# EAGLE schematic hat v1 (EAGLE 9.4.0)

## Sheet 1 of 2
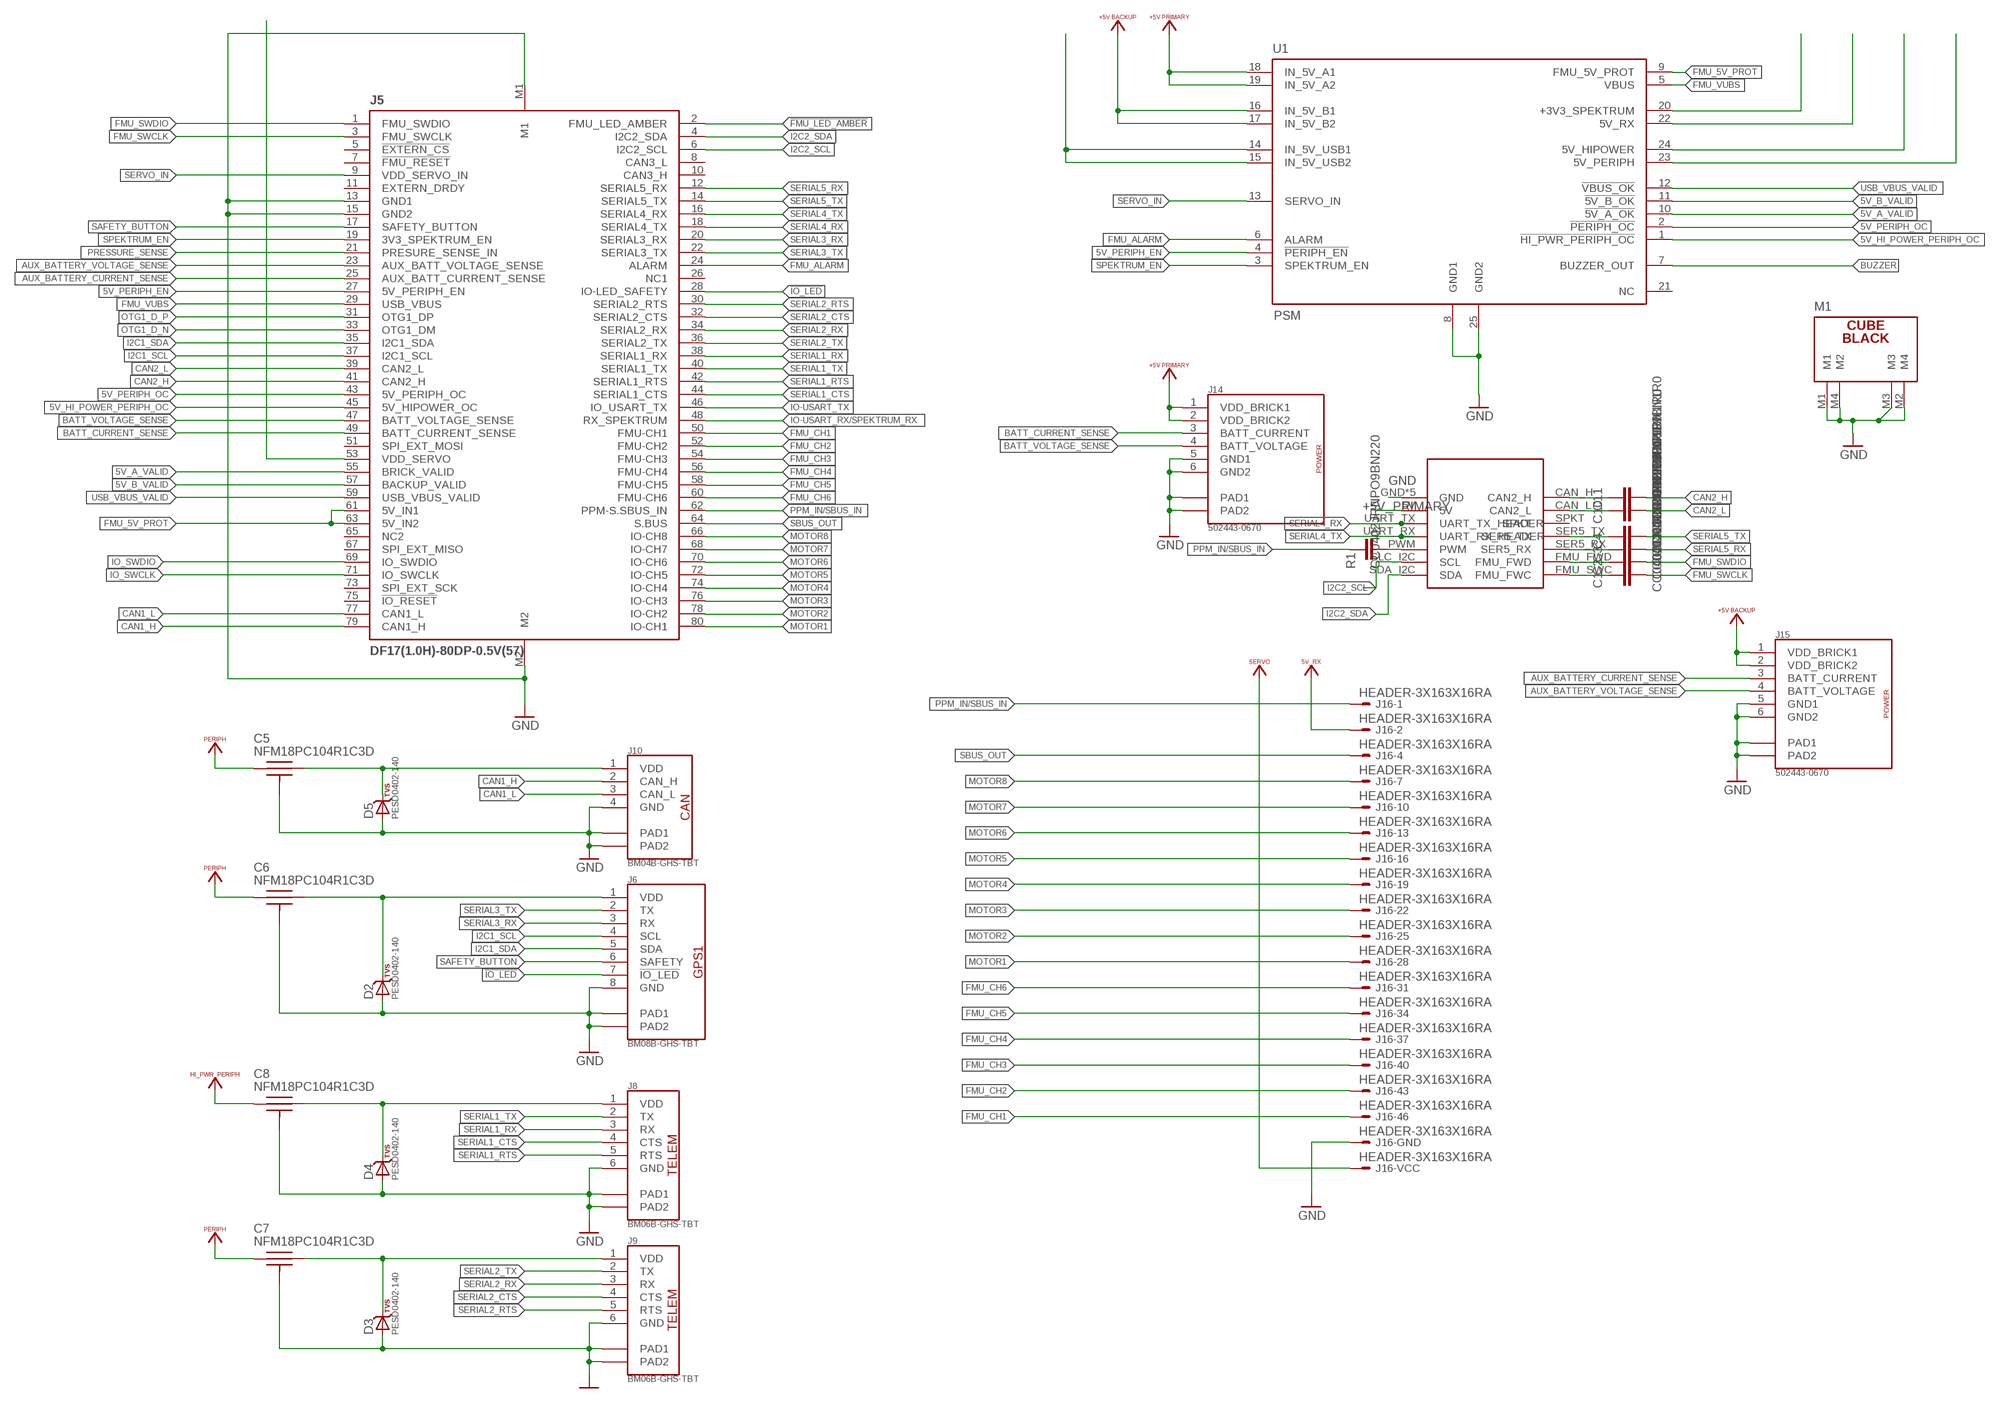
[diagram p0: schematic, sheet 1]

### Parts
C1  CC0402CRNPO9BN1R0  [CAP_0402]
C2  CC0402CRNPO9BN1R0  [CAP_0402]
C3  CC0402CRNPO9BN1R0  [CAP_0402]
C4  CC0402CRNPO9BN1R0  [CAP_0402]
C5  NFM18PC104R1C3D  [KYOCERA-KNH16-DA]
C6  NFM18PC104R1C3D  [KYOCERA-KNH16-DA]
C7  NFM18PC104R1C3D  [KYOCERA-KNH16-DA]
C8  NFM18PC104R1C3D  [KYOCERA-KNH16-DA]
C10  CC0402CRNPO9BN1R0  [CAP_0402]
C11  CC0402CRNPO9BN1R0  [CAP_0402]
D2  PESD0402-140  DIODE-TVS  [0402-TVS]
D3  PESD0402-140  DIODE-TVS  [0402-TVS]
D4  PESD0402-140  DIODE-TVS  [0402-TVS]
D5  PESD0402-140  DIODE-TVS  [0402-TVS]
J5  DF17(1.0H)-80DP-0.5V(57)  [DF17(1.0H)-80DP-0.5V(57)]
J6  BM08B-GHS-TBT  GPS1_CONNECTORS-TBTB  [BM08B-GHS-TBT]
J8  BM06B-GHS-TBT  TELEM_CONNECTORS-TBTB  [BM06B-GHS-TBT]
J9  BM06B-GHS-TBT  TELEM_CONNECTORS-TBTB  [BM06B-GHS-TBT]
J10  BM04B-GHS-TBT  CAN_CONNECTORS-TBTB  [BM04B-GHS-TBT]
J14  502443-0670  POWER_CONNECTOR43  [502443-0670]
J15  502443-0670  POWER_CONNECTOR43  [502443-0670]
J16  HEADER-3X163X16RA  [3X16RA]
M1  CUBE_BLACK  [CUBE]
R1  CC0402JRNPO9BN220  [CAP_0402]
U1  PSM  [PSM]
U$1  RPI  [RPI]

### Nets
5V_A_VALID: J5.55(BRICK_VALID) U1.10(!5V_A_OK)
5V_B_VALID: J5.57(BACKUP_VALID) U1.11(!5V_B_OK)
5V_HI_POWER_PERIPH_OC: J5.45(5V_HIPOWER_OC) U1.1(!HI_PWR_PERIPH_OC)
5V_PERIPH_EN: J5.27(5V_PERIPH_EN) U1.4(!PERIPH_EN)
5V_PERIPH_OC: J5.43(5V_PERIPH_OC) U1.2(!PERIPH_OC)
!FMU_LED_AMBER: J5.2(FMU_LED_AMBER)
!IO_LED: J5.28(IO-LED_SAFETY) J6.7(!IO_LED)
+3V3_SPEKTRUM: U1.20(+3V3_SPEKTRUM)
+5V_BACKUP: J15.1(VDD_BRICK1) J15.2(VDD_BRICK2) U1.16(IN_5V_B1) U1.17(IN_5V_B2)
+5V_PRIMARY: J14.1(VDD_BRICK1) J14.2(VDD_BRICK2) U1.18(IN_5V_A1) U1.19(IN_5V_A2) U$1.5V
AUX_BATTERY_CURRENT_SENSE: J5.25(AUX_BATT_CURRENT_SENSE) J15.3(BATT_CURRENT)
AUX_BATTERY_VOLTAGE_SENSE: J5.23(AUX_BATT_VOLTAGE_SENSE) J15.4(BATT_VOLTAGE)
BATT_CURRENT_SENSE: J5.49(BATT_CURRENT_SENSE) J14.3(BATT_CURRENT)
BATT_VOLTAGE_SENSE: J5.47(BATT_VOLTAGE_SENSE) J14.4(BATT_VOLTAGE)
BUZZER: U1.7(BUZZER_OUT)
CAN1_H: J5.79(CAN1_H) J10.2(CAN_H)
CAN1_L: J5.77(CAN1_L) J10.3(CAN_L)
CAN2_H: C11.2 J5.41(CAN2_H)
CAN2_L: C10.2 J5.39(CAN2_L)
FMU_5V_PROT: J5.61(5V_IN1) J5.63(5V_IN2) U1.9(FMU_5V_PROT)
FMU_ALARM: J5.24(ALARM) U1.6(ALARM)
FMU_CH1: J5.50(FMU-CH1) J16.46
FMU_CH2: J5.52(FMU-CH2) J16.43
FMU_CH3: J5.54(FMU-CH3) J16.40
FMU_CH4: J5.56(FMU-CH4) J16.37
FMU_CH5: J5.58(FMU-CH5) J16.34
FMU_CH6: J5.60(FMU-CH6) J16.31
FMU_SWCLK: C1.2 J5.3(FMU_SWCLK)
FMU_SWDIO: C2.2 J5.1(FMU_SWDIO)
FMU_VUBS: J5.29(USB_VBUS) U1.5(VBUS)
GND: C5.P$3 C5.P$4 C5.P$5 C6.P$3 C6.P$4 C6.P$5 C7.P$3 C7.P$4 C7.P$5 C8.P$3 C8.P$4 C8.P$5 D2.A D3.A D4.A D5.A J5.13(GND1) J5.15(GND2) J5.M1 J5.M2 J6.8(GND) J6.PAD1 J6.PAD2 J8.6(GND) J8.PAD1 J8.PAD2 J9.6(GND) J9.PAD1 J9.PAD2 J10.4(GND) J10.PAD1 J10.PAD2 J14.5(GND1) J14.6(GND2) J14.PAD1 J14.PAD2 J15.5(GND1) J15.6(GND2) J15.PAD1 J15.PAD2 J16.3 J16.6 J16.9 J16.12 J16.15 J16.18 J16.21 J16.24 J16.27 J16.30 J16.33 J16.36 J16.39 J16.42 J16.45 J16.48 M1.M1 M1.M2(M4) M1.M3 M1.M4(M2) U1.8(GND1) U1.25(GND2) U$1.GND U$1.GND1(GND) U$1.GND2(GND) U$1.GND3(GND) U$1.GND4(GND)
I2C1_SCL: J5.37(I2C1_SCL) J6.4(SCL)
I2C1_SDA: J5.35(I2C1_SDA) J6.5(SDA)
I2C2_SCL: J5.6(I2C2_SCL) U$1.SLC_I2C(SCL)
I2C2_SDA: J5.4(I2C2_SDA) U$1.SDA_I2C(SDA)
IO-USART_RX/SPEKTRUM_RX: J5.48(RX_SPEKTRUM)
IO-USART_TX: J5.46(IO_USART_TX)
IO_SWCLK: J5.71(IO_SWCLK)
IO_SWDIO: J5.69(IO_SWDIO)
MOTOR1: J5.80(IO-CH1) J16.28
MOTOR2: J5.78(IO-CH2) J16.25
MOTOR3: J5.76(IO-CH3) J16.22
MOTOR4: J5.74(IO-CH4) J16.19
MOTOR5: J5.72(IO-CH5) J16.16
MOTOR6: J5.70(IO-CH6) J16.13
MOTOR7: J5.68(IO-CH7) J16.10
MOTOR8: J5.66(IO-CH8) J16.7
N$1: C1.1 U$1.FMU_SWC(FMU_FWC)
N$2: C6.P$2 D2.C J6.1(VDD)
N$3: C7.P$2 D3.C J9.1(VDD)
N$4: C8.P$2 D4.C J8.1(VDD)
N$5: C5.P$2 D5.C J10.1(VDD)
N$6: C2.1 U$1.FMU_FWD
N$7: C3.1 U$1.SER5_RX
N$8: R1.2 U$1.PWM
N$9: C4.1 U$1.SER5_TX
N$11: C10.1 U$1.CAN_L(CAN2_L)
N$12: C11.1 U$1.CAN_H(CAN2_H)
OTG1_D_N: J5.33(OTG1_DM)
OTG1_D_P: J5.31(OTG1_DP)
PPM_IN/SBUS_IN: J5.62(PPM-S.SBUS_IN) J16.1 R1.1
PRESSURE_SENSE: J5.21(PRESURE_SENSE_IN)
SAFETY_BUTTON: J5.17(SAFETY_BUTTON) J6.6(SAFETY)
SBUS_OUT: J5.64(S.BUS) J16.4
SERIAL1_CTS: J5.44(SERIAL1_CTS) J8.4(CTS)
SERIAL1_RTS: J5.42(SERIAL1_RTS) J8.5(RTS)
SERIAL1_RX: J5.38(SERIAL1_RX) J8.3(RX)
SERIAL1_TX: J5.40(SERIAL1_TX) J8.2(TX)
SERIAL2_CTS: J5.32(SERIAL2_CTS) J9.4(CTS)
SERIAL2_RTS: J5.30(SERIAL2_RTS) J9.5(RTS)
SERIAL2_RX: J5.34(SERIAL2_RX) J9.3(RX)
SERIAL2_TX: J5.36(SERIAL2_TX) J9.2(TX)
SERIAL3_RX: J5.20(SERIAL3_RX) J6.3(RX)
SERIAL3_TX: J5.22(SERIAL3_TX) J6.2(TX)
SERIAL4_RX: J5.18(SERIAL4_TX) U$1.UART_RX(UART_RX_HEADER)
SERIAL4_TX: J5.16(SERIAL4_RX) U$1.UART_TX(UART_TX_HEADER)
SERIAL5_RX: C3.2 J5.12(SERIAL5_RX)
SERIAL5_TX: C4.2 J5.14(SERIAL5_TX)
SERVO_IN: J5.9(VDD_SERVO_IN) U1.13(SERVO_IN)
SPEKTRUM_EN: J5.19(3V3_SPEKTRUM_EN) U1.3(SPEKTRUM_EN)
USB_VBUS_VALID: J5.59(USB_VBUS_VALID) U1.12(!VBUS_OK)
VBUS: U1.14(IN_5V_USB1) U1.15(IN_5V_USB2)
VCCIO: J16.2 U1.22(5V_RX) ; supply symbol labelled +5V_RX
VDD_HI_PWR_PERIPH: C8.P$1 U1.24(5V_HIPOWER)
VDD_PERIPH: C5.P$1 C6.P$1 C7.P$1 U1.23(5V_PERIPH)
VSERVO: J5.53(VDD_SERVO) J16.5 J16.8 J16.11 J16.14 J16.17 J16.20 J16.23 J16.26 J16.29 J16.32 J16.35 J16.38 J16.41 J16.44 J16.47
Unconnected: J5.5(!EXTERN_CS!) J5.7(!FMU_RESET!) J5.8(CAN3_L) J5.10(CAN3_H) J5.11(EXTERN_DRDY) J5.26(NC1) J5.51(SPI_EXT_MOSI) J5.65(NC2) J5.67(SPI_EXT_MISO) J5.73(SPI_EXT_SCK) J5.75(!IO_RESET!) U1.21(NC) U$1.SPKT

## Sheet 2 of 2

## Library data of the parts
C1-C4 C10 C11 = Resistor_Capacitor:CC0402CRNPO9BN1R0: CAP CER 1PF 50V C0G/NPO 0402 Manufacturer's datasheet <http://www.yageo.com/documents/recent/UPY-GP_NP0_16V-to-50V_16.pdf>; CREATED_BY: PCBLayout.com; DIGIKEY_PART_NUMBER: 311-2076-2-ND; MANUFACTURER: Yageo; MPN: CC0402CRNPO9BN1R0; PACKAGE: SMD 0402
C5-C8 = CubePilotSupport:NFM18PC104R1C3D: Murata Electronics 0.1µF Feed Through Capacitor 16V 2A 30 mOhm 0603 (1608 Metric), 3 PC Pad; PARTNO: NFM18PC104R1C3D
D2-D5 = CubePilotSupport:DIODE-TVS; PARTNO: PESD0402-140
J5 = CubePilotSupport:DF17(1.0H)-80DP-0.5V(57); PARTNO: DF17(1.0H)-80DP-0.5V(57)
J6 = CubePilotSupport:GPS1_CONNECTOR: 8 Postion GH Series Connector 1.25mm Pitch Datasheet <http://www.jst-mfg.com/product/pdf/eng/eGH.pdf>; COLOR: NATURAL/IVORY; PARTNO: BM08B-GHS-TBT; STOCK: Y
J8 J9 = CubePilotSupport:TELEM_CONNECTOR: 6 Postion GH Series Connector 1.25mm Pitch Datasheet <http://www.jst-mfg.com/product/pdf/eng/eGH.pdf>; COLOR: NATURAL/IVORY; PARTNO: BM06B-GHS-TBT(LF)(SN); STOCK: Y
J10 = CubePilotSupport:CAN_CONNECTOR: 4 Postion GH Series Connector 1.25mm Pitch Datasheet <http://www.jst-mfg.com/product/pdf/eng/eGH.pdf>; PARTNO: BM04B-GHS-TBT(LF)(SN); STOCK: Y
J14 J15 = CubePilotSupport:POWER_CONNECTOR; PARTNO: 502443-0670
J16 = CubePilotSupport:HEADER-3X16: 3x16 servo header
M1 = CubePilotSupport:CUBE; COLOR: BLACK; COUNTRY_OF_ORIGIN: TAIWAN
R1 = Resistor_Capacitor:CC0402JRNPO9BN220: CAP CER 22PF 50V C0G/NPO 0402 Manufacturer's datasheet <http://www.yageo.com/documents/recent/UPY-GP_NP0_16V-to-50V_16.pdf>; CREATED_BY: PCBLayout.com; DIGIKEY_PART_NUMBER: 311-1018-2-ND; MANUFACTURER: Yageo; MPN: CC0402JRNPO9BN220; PACKAGE: SMD 0402
U1 = CubePilotSupport:PSM
U$1 = telem_board:RPI